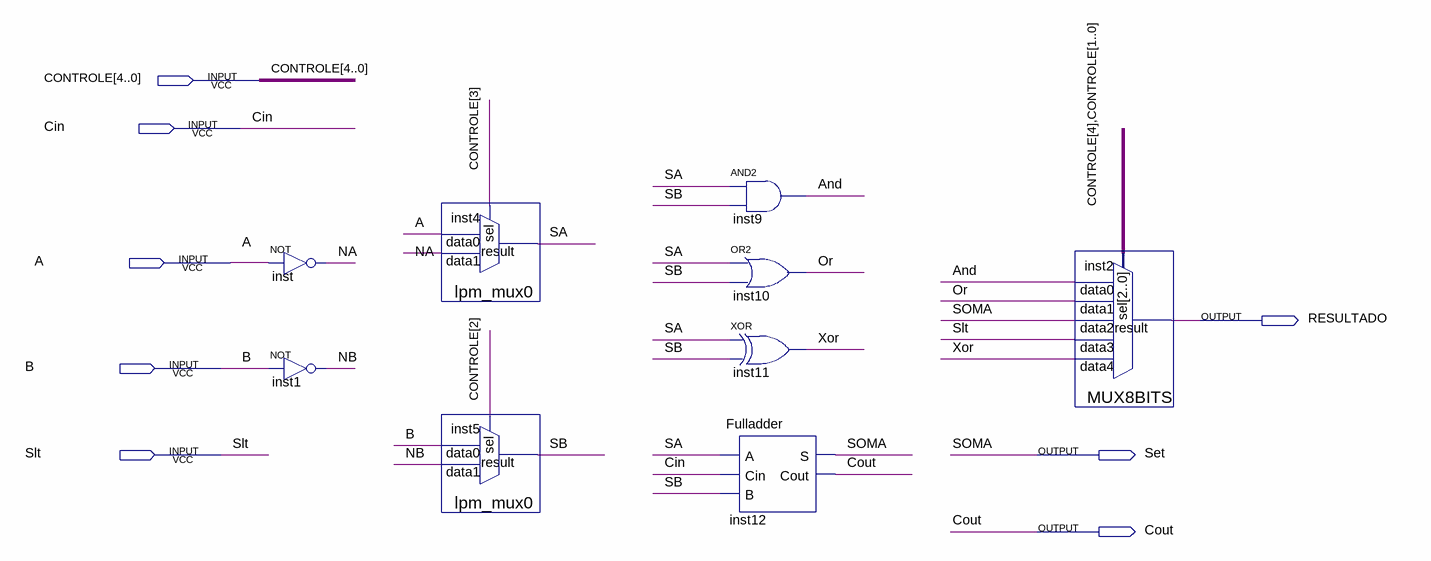
[diagram p0: schematic sheet]
// Quartus schematic Ula_simples.bdf as structural Verilog: 9 symbols, 8 pins
module Ula_simples (
  input  [4:0] CONTROLE,
  input  Cin,
  input  A,
  input  B,
  input  Slt,
  output RESULTADO,
  output Set,
  output Cout
);

  wire And, NA, NB, Or, SA, SB, Xor;

  not inst (NA, A);
  not inst1 (NB, B);
  lpm_mux0 inst4 (.data1(NA), .data0(A), .sel(CONTROLE[3]), .result(SA));
  lpm_mux0 inst5 (.data1(NB), .data0(B), .sel(CONTROLE[2]), .result(SB));
  and inst9 (And, SA, SB);
  or inst10 (Or, SA, SB);
  xor inst11 (Xor, SA, SB);
  Fulladder inst12 (.A(SA), .Cin(Cin), .B(SB), .S(Set), .Cout(Cout));
  MUX8BITS inst2 (
    .data4(Xor), .data3(Slt), .data2(Set), .data1(Or), .data0(And), .sel({CONTROLE[4], CONTROLE[1:0]}),
    .result(RESULTADO));

  // Other names for the same wires on the sheet: SOMA = Set
endmodule
